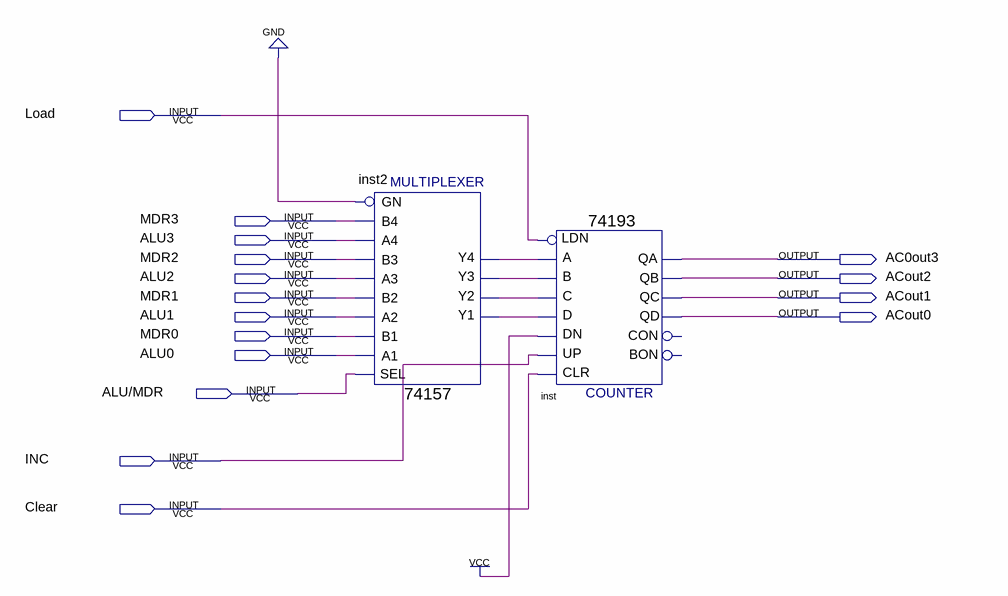
[diagram p0: schematic sheet]
// Quartus schematic ACC.bdf as structural Verilog: 2 symbols, 16 pins
module ACC (
  input  Load,
  input  MDR3,
  input  ALU3,
  input  MDR2,
  input  ALU2,
  input  MDR1,
  input  ALU1,
  input  MDR0,
  input  ALU0,
  input  \ALU/MDR ,
  input  INC,
  input  Clear,
  output AC0out3,
  output ACout2,
  output ACout1,
  output ACout0
);

  wire inst2_y1, inst2_y2, inst2_y3, inst2_y4;

  \74157  inst2 (
    .A1(ALU0), .B1(MDR0), .SEL(\ALU/MDR ), .B2(MDR1), .A3(ALU2), .B3(MDR2), .A2(ALU1), .B4(MDR3), .GN(1'b0),
    .A4(ALU3), .Y2(inst2_y2), .Y1(inst2_y1), .Y4(inst2_y4), .Y3(inst2_y3));
  \74193  inst (
    .D(inst2_y1), .C(inst2_y2), .B(inst2_y3), .A(inst2_y4), .CLR(Clear), .UP(INC), .DN(1'b1), .LDN(Load),
    .QB(ACout2), .QA(AC0out3), .QD(ACout0), .QC(ACout1));  // open: CON, BON
endmodule
